# Altium schematic sheet Audio.SchDoc
size A4; Revision: D.1(PCB.SCH)
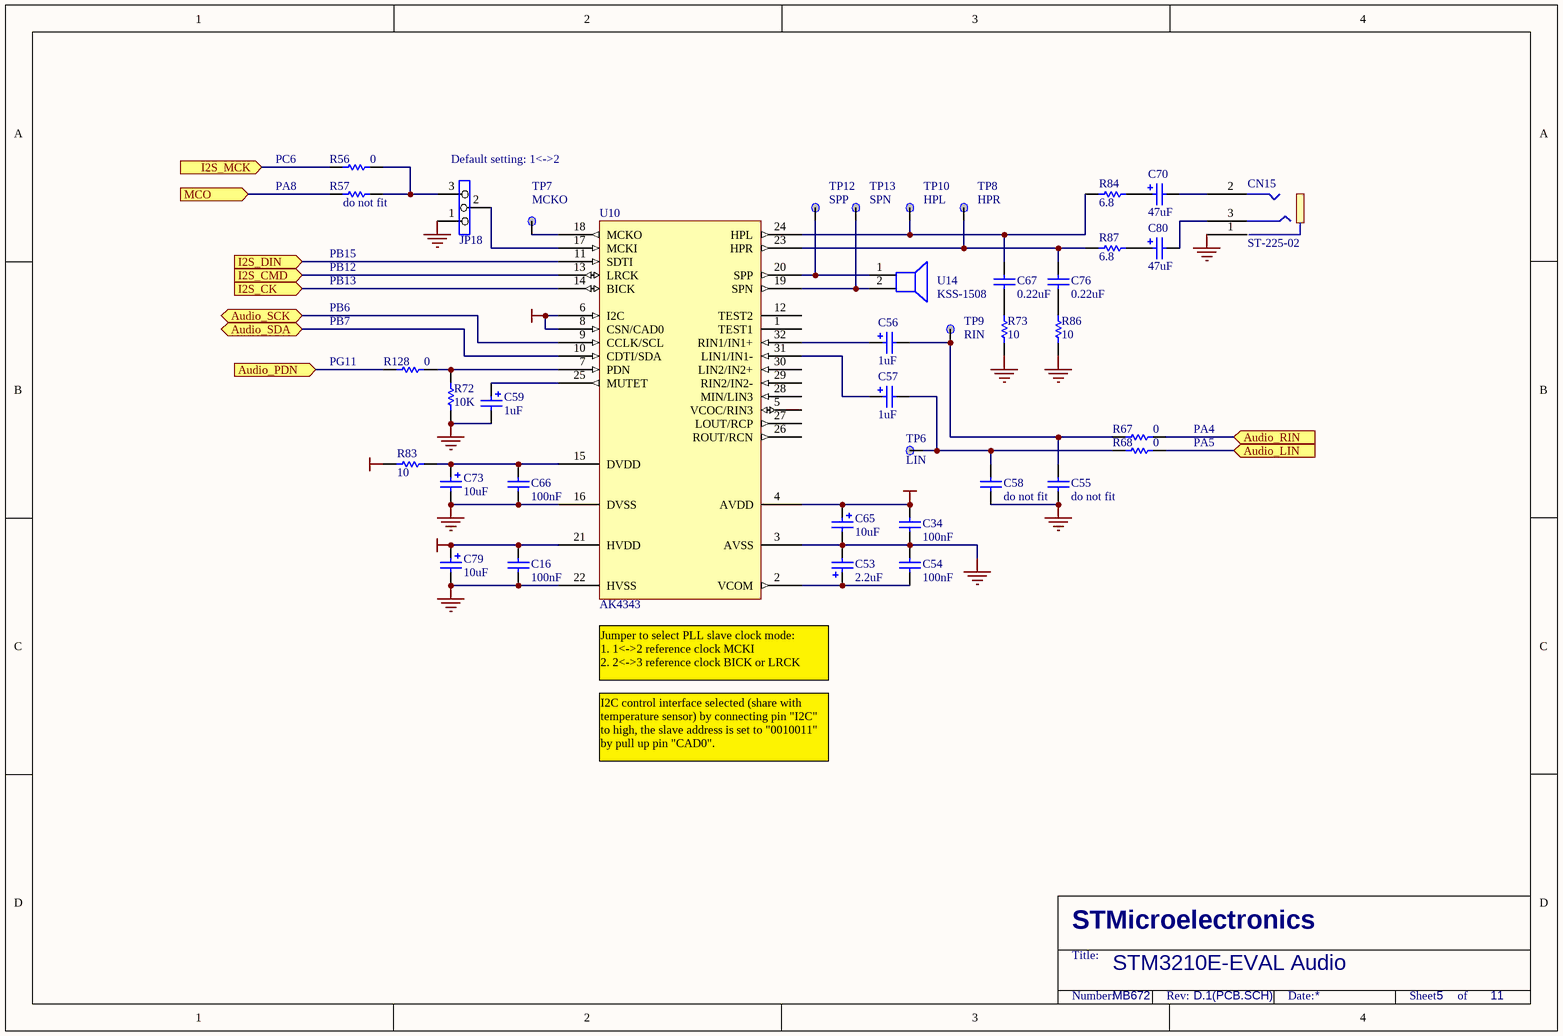
[diagram p0: Audio.SchDoc]

## Parts
C16  100nF  [0603P]
C34  100nF  [0603P]
C53  2.2uF  [C160M]
C54  100nF  [0603P]
C55  do not fit  [0603P]
C56  1uF  [C160M]
C57  1uF  [C160M]
C58  do not fit  [0603P]
C59  1uF  [C160M]
C65  10uF  [C160M]
C66  100nF  [0603P]
C67  0.22uF  [0603P]
C70  47uF  [C160M]
C73  10uF  [C160M]
C76  0.22uF  [0603P]
C79  10uF  [C160M]
C80  47uF  [C160M]
CN15  ST-225-02
JP18  (no value)  [SIP3]
R56  0  [0603]
R57  do not fit  [0603]
R67  0  [0603]
R68  0  [0603]
R72  10K  [0603]
R73  10  [0603]
R83  10  [0603]
R84  6.8  [0603]
R86  10  [0603]
R87  6.8  [0603]
R128  0  [0603]
TP6  LIN  [TP]
TP7  MCKO  [TP]
TP8  HPR  [TP]
TP9  RIN  [TP]
TP10  HPL  [TP]
TP12  SPP  [TP]
TP13  SPN  [TP]
U10  AK4343  [QFN32]
U14  KSS-1508  [KS1508]

## Ports
Audio_LIN (in), Audio_PDN (in), Audio_RIN (in), Audio_SCK (bidir), Audio_SDA (bidir), I2S_CK (in), I2S_CMD (in), I2S_DIN (in), I2S_MCK (in), MCO (in)

## Nets
+3V3: C16.1 C34.2 C65.1 C79.1 R83.2 U10.4(AVDD) U10.6(I2C) U10.8(CSN/CAD0) U10.21(HVDD)
GND: C16.2 C34.1 C53.2 C54.2 C55.1 C58.1 C59.2 C65.2 C66.2 C73.2 C79.2 CN15.1 JP18.1 R72.2 R73.2 R86.2 U10.3(AVSS) U10.16(DVSS) U10.22(HVSS)
Audio_LIN: R68.2 ; port Audio_LIN
Audio_PDN: R128.2 ; port Audio_PDN
Audio_RIN: R67.2 ; port Audio_RIN
Audio_SCK: U10.9(CCLK/SCL) ; port Audio_SCK
Audio_SDA: U10.10(CDTI/SDA) ; port Audio_SDA
I2S_CK: U10.14(BICK) ; port I2S_CK
I2S_CMD: U10.13(LRCK) ; port I2S_CMD
I2S_DIN: U10.11(SDTI) ; port I2S_DIN
I2S_MCK: R56.2 ; port I2S_MCK
MCO: R57.2 ; port MCO
NetC53_1: C53.1 C54.1 U10.2(VCOM)
NetC55_2: C55.2 C56.2 R67.1 TP9.1
NetC56_1: C56.1 U10.32(RIN1/IN1+)
NetC57_1: C57.1 U10.31(LIN1/IN1-)
NetC57_2: C57.2 C58.2 R68.1 TP6.1
NetC59_1: C59.1 U10.25(MUTET)
NetC66_1: C66.1 C73.1 R83.1 U10.15(DVDD)
NetC67_1: C67.1 R84.2 TP10.1 U10.24(HPL)
NetC67_2: C67.2 R73.1
NetC70_1: C70.1 R84.1
NetC70_2: C70.2 CN15.2
NetC76_1: C76.1 R87.2 TP8.1 U10.23(HPR)
NetC76_2: C76.2 R86.1
NetC80_1: C80.1 R87.1
NetC80_2: C80.2 CN15.3
NetJP18_2: JP18.2 U10.17(MCKI)
NetJP18_3: JP18.3 R56.1 R57.1
NetR72_1: R72.1 R128.1 U10.7(PDN)
NetTP7_1: TP7.1 U10.18(MCKO)
NetTP12_1: TP12.1 U10.20(SPP) U14.1(+)
NetTP13_1: TP13.1 U10.19(SPN) U14.2(-)

Not connected (* = marked no-connect by the designer): U10 1(TEST1) 5(VCOC/RIN3) 12(TEST2) 26(ROUT/RCN) 27(LOUT/RCP) 28(MIN/LIN3) 29(RIN2/IN2-) 30(LIN2/IN2+)

## Notes on the sheet
- PC6
- (near JP18) Default setting: 1<->2
- PA8
- PB12
- PB13
- PB15
- PB6
- PB7
- (near R128) PG11
- PA5
- PA4
- Jumper to select PLL slave clock mode:
  1. 1<->2 reference clock MCKI
  2. 2<->3 reference clock BICK or LRCK
- I2C control interface selected (share with temperature sensor) by connecting pin "I2C" to high, the slave address is set to "0010011"  by pull up pin "CAD0".
- STM3210E-EVAL Audio
- MB672
- 5
- 11
- STMicroelectronics
- Title:
- Number:
- Rev:
- Date:
- Sheet       of

## Library data of the parts
C16 C34 C54 C66 = CAP: Capacitor; Published: 8-Jun-2000; Revision: July-2002: Re-released for DXP Platform.; Publisher: Altium Limited; Value: 100nF
C53 C56 C57 C59 C65 C73 C79 = Cap Pol1: Polarized Capacitor (Radial); Value: 47uF; Published: 8-Jun-2000; Revision: July-2002: Re-released for DXP Platform.; Publisher: Altium Limited
C55 C58 C67 C76 = CAP: Capacitor; Value: 100nF; Published: 8-Jun-2000; Revision: July-2002: Re-released for DXP Platform.; Publisher: Altium Limited
C70 C80 = Cap Pol1: Polarized Capacitor (Radial); Published: 8-Jun-2000; Revision: July-2002: Re-released for DXP Platform.; Publisher: Altium Limited; Value: 47uF
JP18 = Jumper3
R56 R57 R67 R68 R72 R73 R83 R84 R86 R87 R128 = res1: Resistor; Value: 1K; Published: 8-Jun-2000; Revision: July-2002: Re-released for DXP Platform.; Publisher: Altium Limited
TP6-TP10 TP12 TP13 = TP
U14 = Speaker: Loudspeaker; Published: 24-Mar-1999; Revision: July-2002: Re-released for DXP Platform.; Publisher: Altium Limited